# Altium project CurrentMitter.PrjPcb
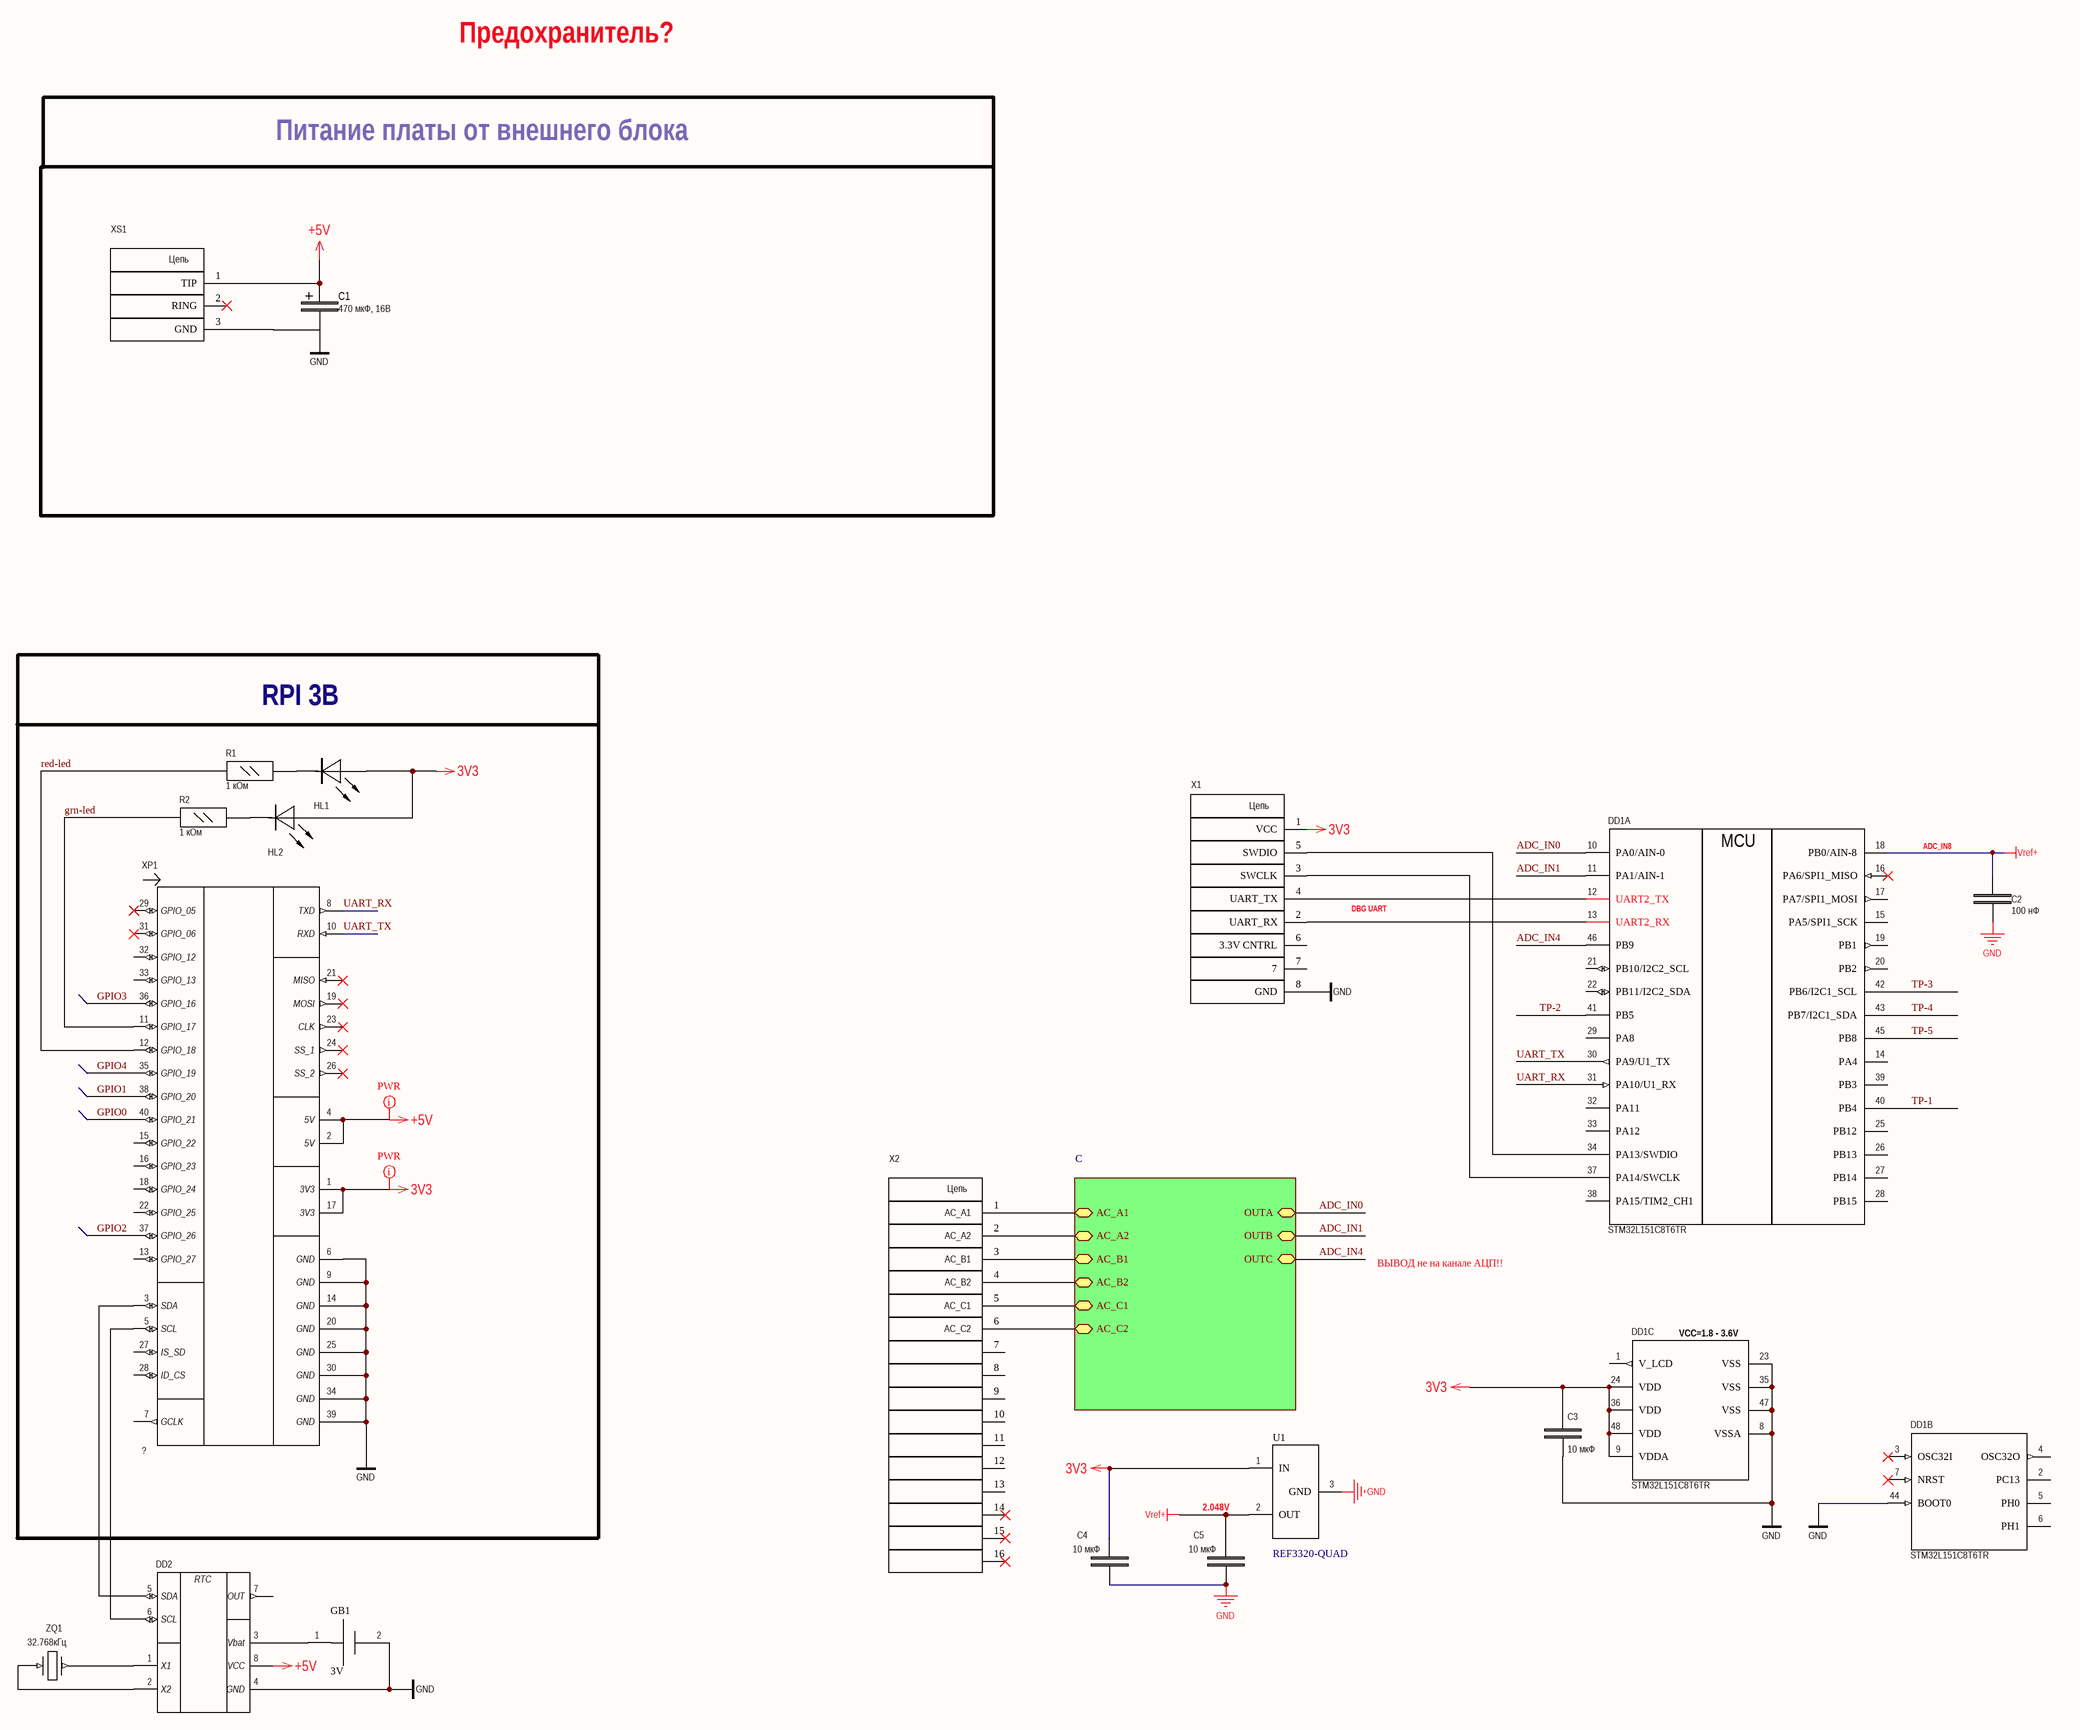
[diagram p0: main.SchDoc]
2 sheets, 46 parts. Net scope: hierarchical (ports join the sheet entries above them; power ports are global).
Board file: pcb.PcbDoc
Sheets:
  main.SchDoc
    C = current_sensor.SchDoc

## Sheet main.SchDoc
size A2

### Parts
C1  470 мкФ, 16В  [ECAP 10x10.5 SMD]
C2  100 нФ  [CAP0402]
C3  10 мкФ  [CAP0805]
C4  10 мкФ  [CAP0805]
C5  10 мкФ  [CAP0805]
DD1  STM32L151C8T6TR  [LQFP-48]  (parts A,B,C of 3)
DD2  ?  [So-8]  (value not drawn)
GB1  3V  [CRC2032 BAT holder]
HL1  LED  [LED 3MM R RED]  (value not drawn)
HL2  LED  [LED 3MM R GREEN]  (value not drawn)
R1  value 1 кОм  [RES0402]  (hidden comment: RES0805)
R2  value 1 кОм  [RES0402]  (hidden comment: RES0805)
U1  REF3320-QUAD  [SOT-23-3v2]
X1  ?  [PBD-08 - POGO PIN]  (value not drawn)
X2  ?  [microfit30_16]  (value not drawn)
XP1  ?  [PBD-40 2.54 RPI]
XS1  Гнездо питания DS-210  [DS-210]  (value not drawn)
ZQ1  32.768кГц  [Crystal_1_V1]

### Blocks framed on the sheet
RPI 3B: HL1 HL2 R1 R2 XP1

### Sub-sheets
C = current_sensor.SchDoc: AC_A1, AC_A2, AC_B1, AC_B2, AC_C1, AC_C2, OUTA, OUTB, OUTC

### Nets
3V3: C3.2 C4.2 DD1.9(VDDA) DD1.24(VDD) DD1.36(VDD) DD1.48(VDD) HL1.A(Anode) HL2.A(Anode) U1.1(IN) X1.1(VCC) XP1.1(3V3) XP1.17(3V3)
+5V: C1.1 DD2.8(VCC) XP1.2(5V) XP1.4(5V) XS1.1(TIP)
GND: C1.2 C2.1 C3.1 C4.1 C5.1 DD1.8(VSSA) DD1.23(VSS) DD1.35(VSS) DD1.44(BOOT0) DD1.47(VSS) DD2.4(GND) GB1.2(minus) U1.3(GND) X1.8(GND) XP1.6(GND) XP1.9(GND) XP1.14(GND) XP1.20(GND) XP1.25(GND) XP1.30(GND) XP1.34(GND) XP1.39(GND) XS1.3(GND)
Vref+: C2.2 C5.2 DD1.18(PB0/AIN-8) U1.2(OUT)
ADC_IN0: DD1.10(PA0/AIN-0) ; sheet C/OUTA
ADC_IN1: DD1.11(PA1/AIN-1) ; sheet C/OUTB
ADC_IN4: DD1.46(PB9) ; sheet C/OUTC
GPIO0: XP1.40(GPIO_21)
GPIO1: XP1.38(GPIO_20)
GPIO2: XP1.37(GPIO_26)
GPIO3: XP1.36(GPIO_16)
GPIO4: XP1.35(GPIO_19)
grn-led: R2.2 XP1.11(GPIO_17)
red-led: R1.2 XP1.12(GPIO_18)
TP-1: DD1.40(PB4)
TP-2: DD1.41(PB5)
TP-3: DD1.42(PB6/I2C1_SCL)
TP-4: DD1.43(PB7/I2C1_SDA)
TP-5: DD1.45(PB8)
UART_RX: DD1.31(PA10/U1_RX) XP1.8(TXD)
UART_TX: DD1.30(PA9/U1_TX) XP1.10(RXD)
NetC6_1: X2.1(AC_A1) ; sheet C/AC_A1
NetC6_2: X2.2(AC_A2) ; sheet C/AC_A2
NetC9_1: X2.3(AC_B1) ; sheet C/AC_B1
NetC9_2: X2.4(AC_B2) ; sheet C/AC_B2
NetC10_1: X2.5(AC_C1) ; sheet C/AC_C1
NetC10_2: X2.6(AC_C2) ; sheet C/AC_C2
NetDD1_12: DD1.12(UART2_TX) X1.4(UART_TX)
NetDD1_13: DD1.13(UART2_RX) X1.2(UART_RX)
NetDD1_34: DD1.34(PA13/SWDIO) X1.5(SWDIO)
NetDD1_37: DD1.37(PA14/SWCLK) X1.3(SWCLK)
NetDD2_1: DD2.1(X1) ZQ1.1
NetDD2_2: DD2.2(X2) ZQ1.2
NetDD2_3: DD2.3(Vbat) GB1.1(plus)
NetDD2_5: DD2.5(SDA) XP1.3(SDA)
NetDD2_6: DD2.6(SCL) XP1.5(SCL)
NetHL1_C: HL1.C(Cathode) R1.1
NetHL2_C: HL2.C(Cathode) R2.1

Not connected (* = marked no-connect by the designer): DD1 1(V_LCD) 2(PC13) 3(OSC32I)* 4(OSC32O) 5(PH0) 6(PH1) 7(NRST)* 14(PA4) 15(PA5/SPI1_SCK) 16(PA6/SPI1_MISO)* 17(PA7/SPI1_MOSI) 19(PB1) 20(PB2) 21(PB10/I2C2_SCL) 22(PB11/I2C2_SDA) 25(PB12) 26(PB13) 27(PB14) 28(PB15) 29(PA8) 32(PA11) 33(PA12) 38(PA15/TIM2_CH1) 39(PB3); DD2 7(OUT); X1 6(3.3V_CNTRL) 7; X2 7 8 9 10 11 12 13 14* 15* 16*; XP1 7(GCLK) 13(GPIO_27) 15(GPIO_22) 16(GPIO_23) 18(GPIO_24) 19(MOSI)* 21(MISO)* 22(GPIO_25) 23(CLK)* 24(SS_1)* 26(SS_2)* 27(IS_SD) 28(ID_CS) 29(GPIO_05)* 31(GPIO_06)* 32(GPIO_12) 33(GPIO_13); XS1 2(RING)*

### Layout directives
net class Undefined: 3V3, +5V

### Notes on the sheet
- Предохранитель?
- Питание платы от внешнего блока
- ADC_IN8
- DBG UART
- ВЫВОД не на канале АЦП!!
- (near DD1) VCC=1.8 - 3.6V
- 2.048V
- (in symbol DS1307) RTC
- (in symbol IDC-16-MR) Цепь
- (in symbol STM32L151C8T6TR, part A) MCU
- (in symbol Гнездо питания DC005 5.5x2.5) Цепь
- (in symbol Разьем_8_под_pogopin) Цепь

### Library data of the parts
C1 = Конденсатор_полярный: value: 470 мкФ, 16В
C2 C3 = CAP0805: Конденсатор
  C2: value: 100 нФ; price: 0.1
  C3: value: 10 мкФ; price: 1
C4 C5 = CAP0805: value: 10 мкФ; price: 0.1
DD1 = STM32L151C8T6TR: Микроконтроллер; Value: *; price: 107
DD2 = DS1307: I2C Real-Time Clock; type: ?; value: ?
GB1 = CRC2032 Bat holder
HL1 = LED: Светодиод зеленый; Type: ?; value: ?; price: 1.5
HL2 = LED: Светодиод красный; Type: ?; value: ?; price: 1.5
R1 R2 = RES0805: Резистор 0805; price: 0.1
U1 = REF3333-QUAD: PCB: SOT-23; vref: 2.048V; partid: REF3320; link: https://www.aliexpress.com/item/Free-Shipping-REF3320AIDCKR-REF3320AIDCKT-REF3320-R20/32890922006.html?spm=2114.search0604.3.1.52933561mvZQ8T&ws_ab_test=searchweb0_0,searchweb201602_1_10065_10068_319_317_10696_453_10084_454_10083_10618_10307_10301_537_536_10902_10059_10884_10889_10887_321_322_10915_10103_10914_10911_10910,searchweb201603_51,ppcSwitch_0&algo_expid=3bee8939-0ad4-47b9-8e08-02eb205603b1-0&algo_pvid=3bee8939-0ad4-47b9-8e08-02eb205603b1&transAbTest=ae803_3
X1 = Разьем_8_под_pogopin: Type: ?; value: ?
X2 = IDC-16-MR: Type: ?; value: ?
XP1 = Raspberry Pi 3 Header: Type: ?; value: ?
XS1 = Гнездо питания DC005 5.5x2.5: 2.5x5.5мм
ZQ1 = 32.768 кГц: Кварцевый резонатор; Type: ?; value: 32.768кГц; price: 6

## Sheet current_sensor.SchDoc
size A4
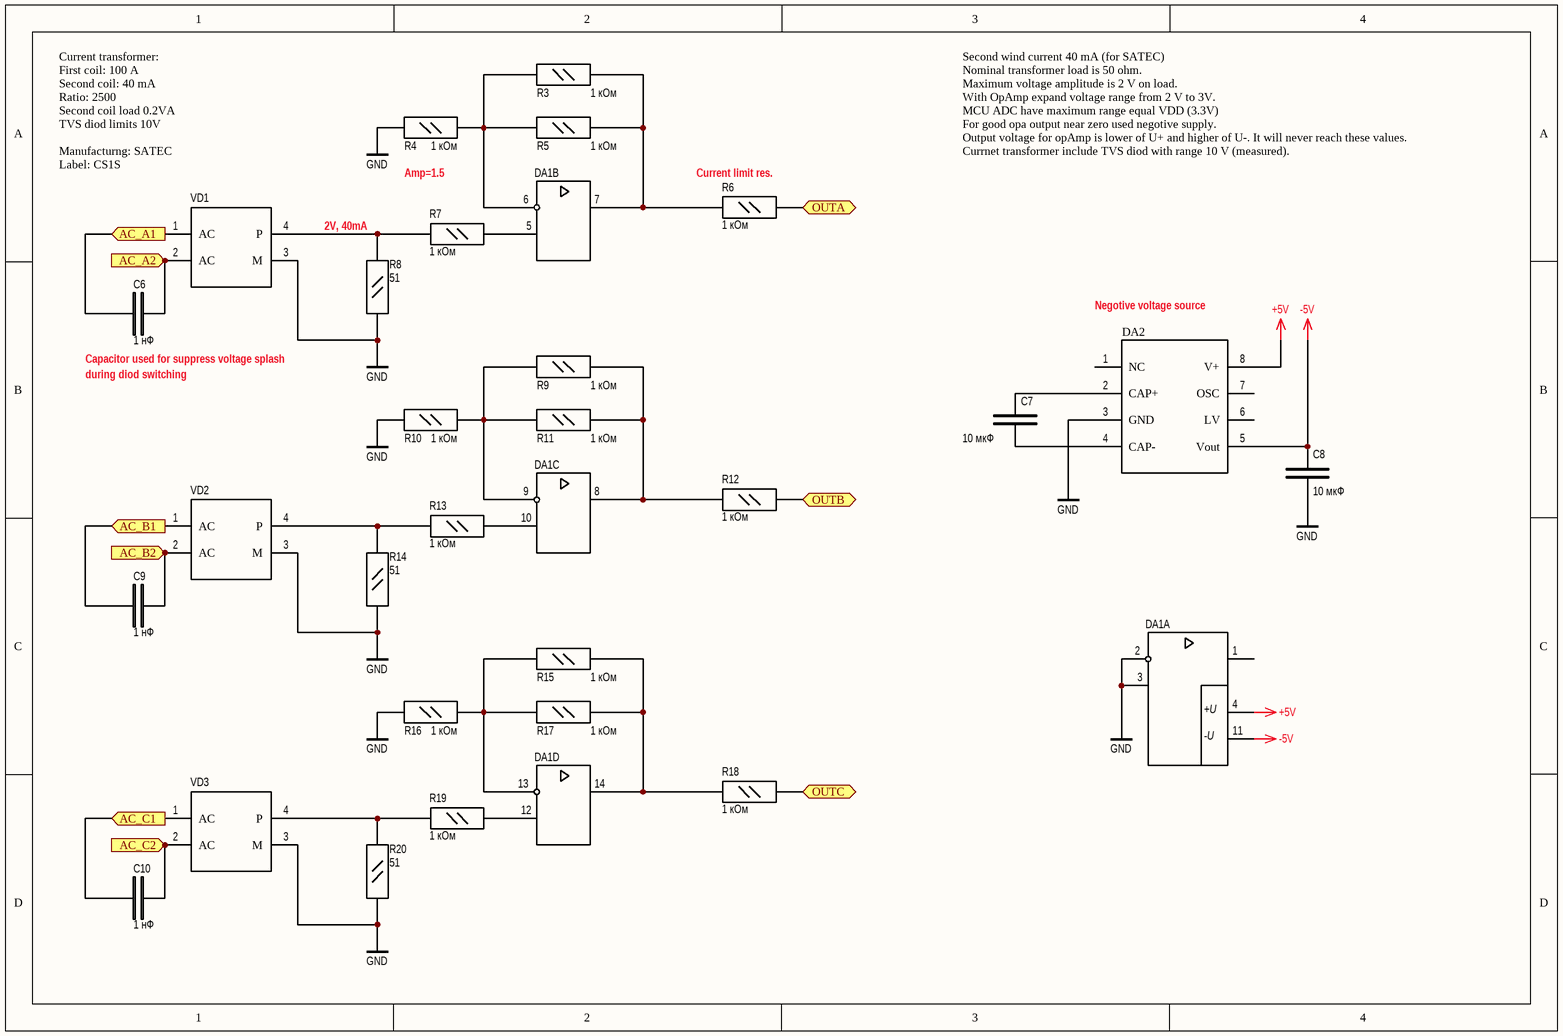
[diagram p1: current_sensor.SchDoc]

### Parts
C6  1 нФ  [CAP0402-LONG]
C7  10 мкФ  [CAP0805]
C8  10 мкФ  [CAP0805]
C9  1 нФ  [CAP0402-LONG]
C10  1 нФ  [CAP0402-LONG]
DA1  ?  [SO-14]  (value not drawn)  (parts A,B,C,D of 4)
DA2  ICL7660A  [So-8]  (value not drawn)
R3  value 1 кОм  [RES0402-LONG]  (hidden comment: RES0805)
R4  value 1 кОм  [RES0402-LONG]  (hidden comment: RES0805)
R5  value 1 кОм  [RES0402-LONG]  (hidden comment: RES0805)
R6  value 1 кОм  [RES0402-LONG]  (hidden comment: RES0805)
R7  value 1 кОм  [RES0402-LONG]  (hidden comment: RES0805)
R8  value 51  [RES0805]  (hidden comment: Резистор 0.125Вт)
R9  value 1 кОм  [RES0402-LONG]  (hidden comment: RES0805)
R10  value 1 кОм  [RES0402-LONG]  (hidden comment: RES0805)
R11  value 1 кОм  [RES0402-LONG]  (hidden comment: RES0805)
R12  value 1 кОм  [RES0402-LONG]  (hidden comment: RES0805)
R13  value 1 кОм  [RES0402-LONG]  (hidden comment: RES0805)
R14  value 51  [RES0805]  (hidden comment: Резистор 0.125Вт)
R15  value 1 кОм  [RES0402-LONG]  (hidden comment: RES0805)
R16  value 1 кОм  [RES0402-LONG]  (hidden comment: RES0805)
R17  value 1 кОм  [RES0402-LONG]  (hidden comment: RES0805)
R18  value 1 кОм  [RES0402-LONG]  (hidden comment: RES0805)
R19  value 1 кОм  [RES0402-LONG]  (hidden comment: RES0805)
R20  value 51  [RES0805]  (hidden comment: Резистор 0.125Вт)
VD1  DB-1MS  [DB1MA]  (value not drawn)
VD2  DB-1MS  [DB1MA]  (value not drawn)
VD3  DB-1MS  [DB1MA]  (value not drawn)

### Ports
AC_A1 (in), AC_A2 (in), AC_B1 (in), AC_B2 (in), AC_C1 (in), AC_C2 (in), OUTA (in), OUTB (in), OUTC (in)

### Nets
+5V: DA1.4(U+) DA2.8(V+)
-5V: C8.2 DA1.11(U-) DA2.5(Vout)
GND: C8.1 DA1.2(IN1-) DA1.3(IN1+) DA2.3(GND) R4.2 R8.1 R10.2 R14.1 R16.2 R20.1 VD1.3(M) VD2.3(M) VD3.3(M)
ADC_IN0: R6.1 ; port OUTA
ADC_IN1: R12.1 ; port OUTB
ADC_IN4: R18.1 ; port OUTC
NetC6_1: C6.1 VD1.1(AC) ; port AC_A1
NetC6_2: C6.2 VD1.2(AC) ; port AC_A2
NetC7_1: C7.1 DA2.4(CAP-)
NetC7_2: C7.2 DA2.2(CAP+)
NetC9_1: C9.1 VD2.1(AC) ; port AC_B1
NetC9_2: C9.2 VD2.2(AC) ; port AC_B2
NetC10_1: C10.1 VD3.1(AC) ; port AC_C1
NetC10_2: C10.2 VD3.2(AC) ; port AC_C2
NetDA1_5: DA1.5(IN2+) R7.1
NetDA1_6: DA1.6(IN2-) R3.2 R4.1 R5.2
NetDA1_7: DA1.7(OUT2) R3.1 R5.1 R6.2
NetDA1_8: DA1.8(OUT3) R9.1 R11.1 R12.2
NetDA1_9: DA1.9(IN3-) R9.2 R10.1 R11.2
NetDA1_10: DA1.10(IN3+) R13.1
NetDA1_12: DA1.12(IN4+) R19.1
NetDA1_13: DA1.13(IN4-) R15.2 R16.1 R17.2
NetDA1_14: DA1.14(OUT4) R15.1 R17.1 R18.2
NetR7_2: R7.2 R8.2 VD1.4(P)
NetR13_2: R13.2 R14.2 VD2.4(P)
NetR19_2: R19.2 R20.2 VD3.4(P)

Not connected (* = marked no-connect by the designer): DA1 1(OUT1); DA2 1(NC) 6(LV) 7(OSC)

### Notes on the sheet
- Current transformer:
  First coil: 100 A
  Second coil: 40 mA
  Ratio: 2500
  Second coil load 0.2VA
  TVS diod limits 10V
  Manufacturng: SATEC
  Label: CS1S
- Amp=1.5
- (near R6) Current limit res.
- Second wind current 40 mA (for SATEC)
  Nominal transformer load is 50 ohm.
  Maximum voltage amplitude is 2 V on load.
  With OpAmp expand voltage range from 2 V to 3V.
  MCU ADC have maximum range equal VDD (3.3V)
  For good opa output near zero used negotive supply.
  Output voltage for opAmp is lower of U+ and higher of U-. It will never reach these values.
  Currnet transformer include TVS diod with range 10 V (measured).
- (near R8) 2V, 40mA
- (near DA2) Negotive voltage source
- Capacitor used for suppress voltage splash
- during diod switching
- (in symbol LM324, part A) +U; -U

### Library data of the parts
C6-C10 = CAP0805: Конденсатор
  C6 C9 C10: value: 1 нФ; price: 0.1
  C7 C8: value: 10 мкФ; price: 1
DA1 = LM324: Low Power Quad Operational Amplifiers; Type: ?; Value: ?
DA2 = ICL7660A: PartNumber: ICL7660A,ICL7660AIBAZA-T; Shop 1: Терраэлектроника; Shop 2: Элитан; Price 1: 58 ( 1 шт); Price 2: 164 ( от 10 шт); Link 1: https://www.terraelectronica.ru/product/866952; Link 2: https://www.elitan.ru/price/item155984395
R3-R7 R9-R13 R15-R19 = RES0805: Резистор 0805; price: 0.1
VD1-VD3 = DB-1MS: Type: ?; value: ?

## Nets that join several sheets
+5V: main (5 pins), current_sensor (DA1.4 DA2.8)
GND: main (23 pins), current_sensor (13 pins)
ADC_IN0: main (DD1.10), current_sensor (R6.1)
ADC_IN1: main (DD1.11), current_sensor (R12.1)
ADC_IN4: main (DD1.46), current_sensor (R18.1)
NetC6_1: main (X2.1), current_sensor (C6.1 VD1.1)
NetC6_2: main (X2.2), current_sensor (C6.2 VD1.2)
NetC9_1: main (X2.3), current_sensor (C9.1 VD2.1)
NetC9_2: main (X2.4), current_sensor (C9.2 VD2.2)
NetC10_1: main (X2.5), current_sensor (C10.1 VD3.1)
NetC10_2: main (X2.6), current_sensor (C10.2 VD3.2)